# EasyEDA schematic SCH_Fetch Execution Counter_2021-10-10.json
TITLE: Fetch Execution Counter; REV: 1.0; Date: 2021-09-30; Sheet: 1/1; Drawn By: MarcosObel; Company: Zutup All Electronics
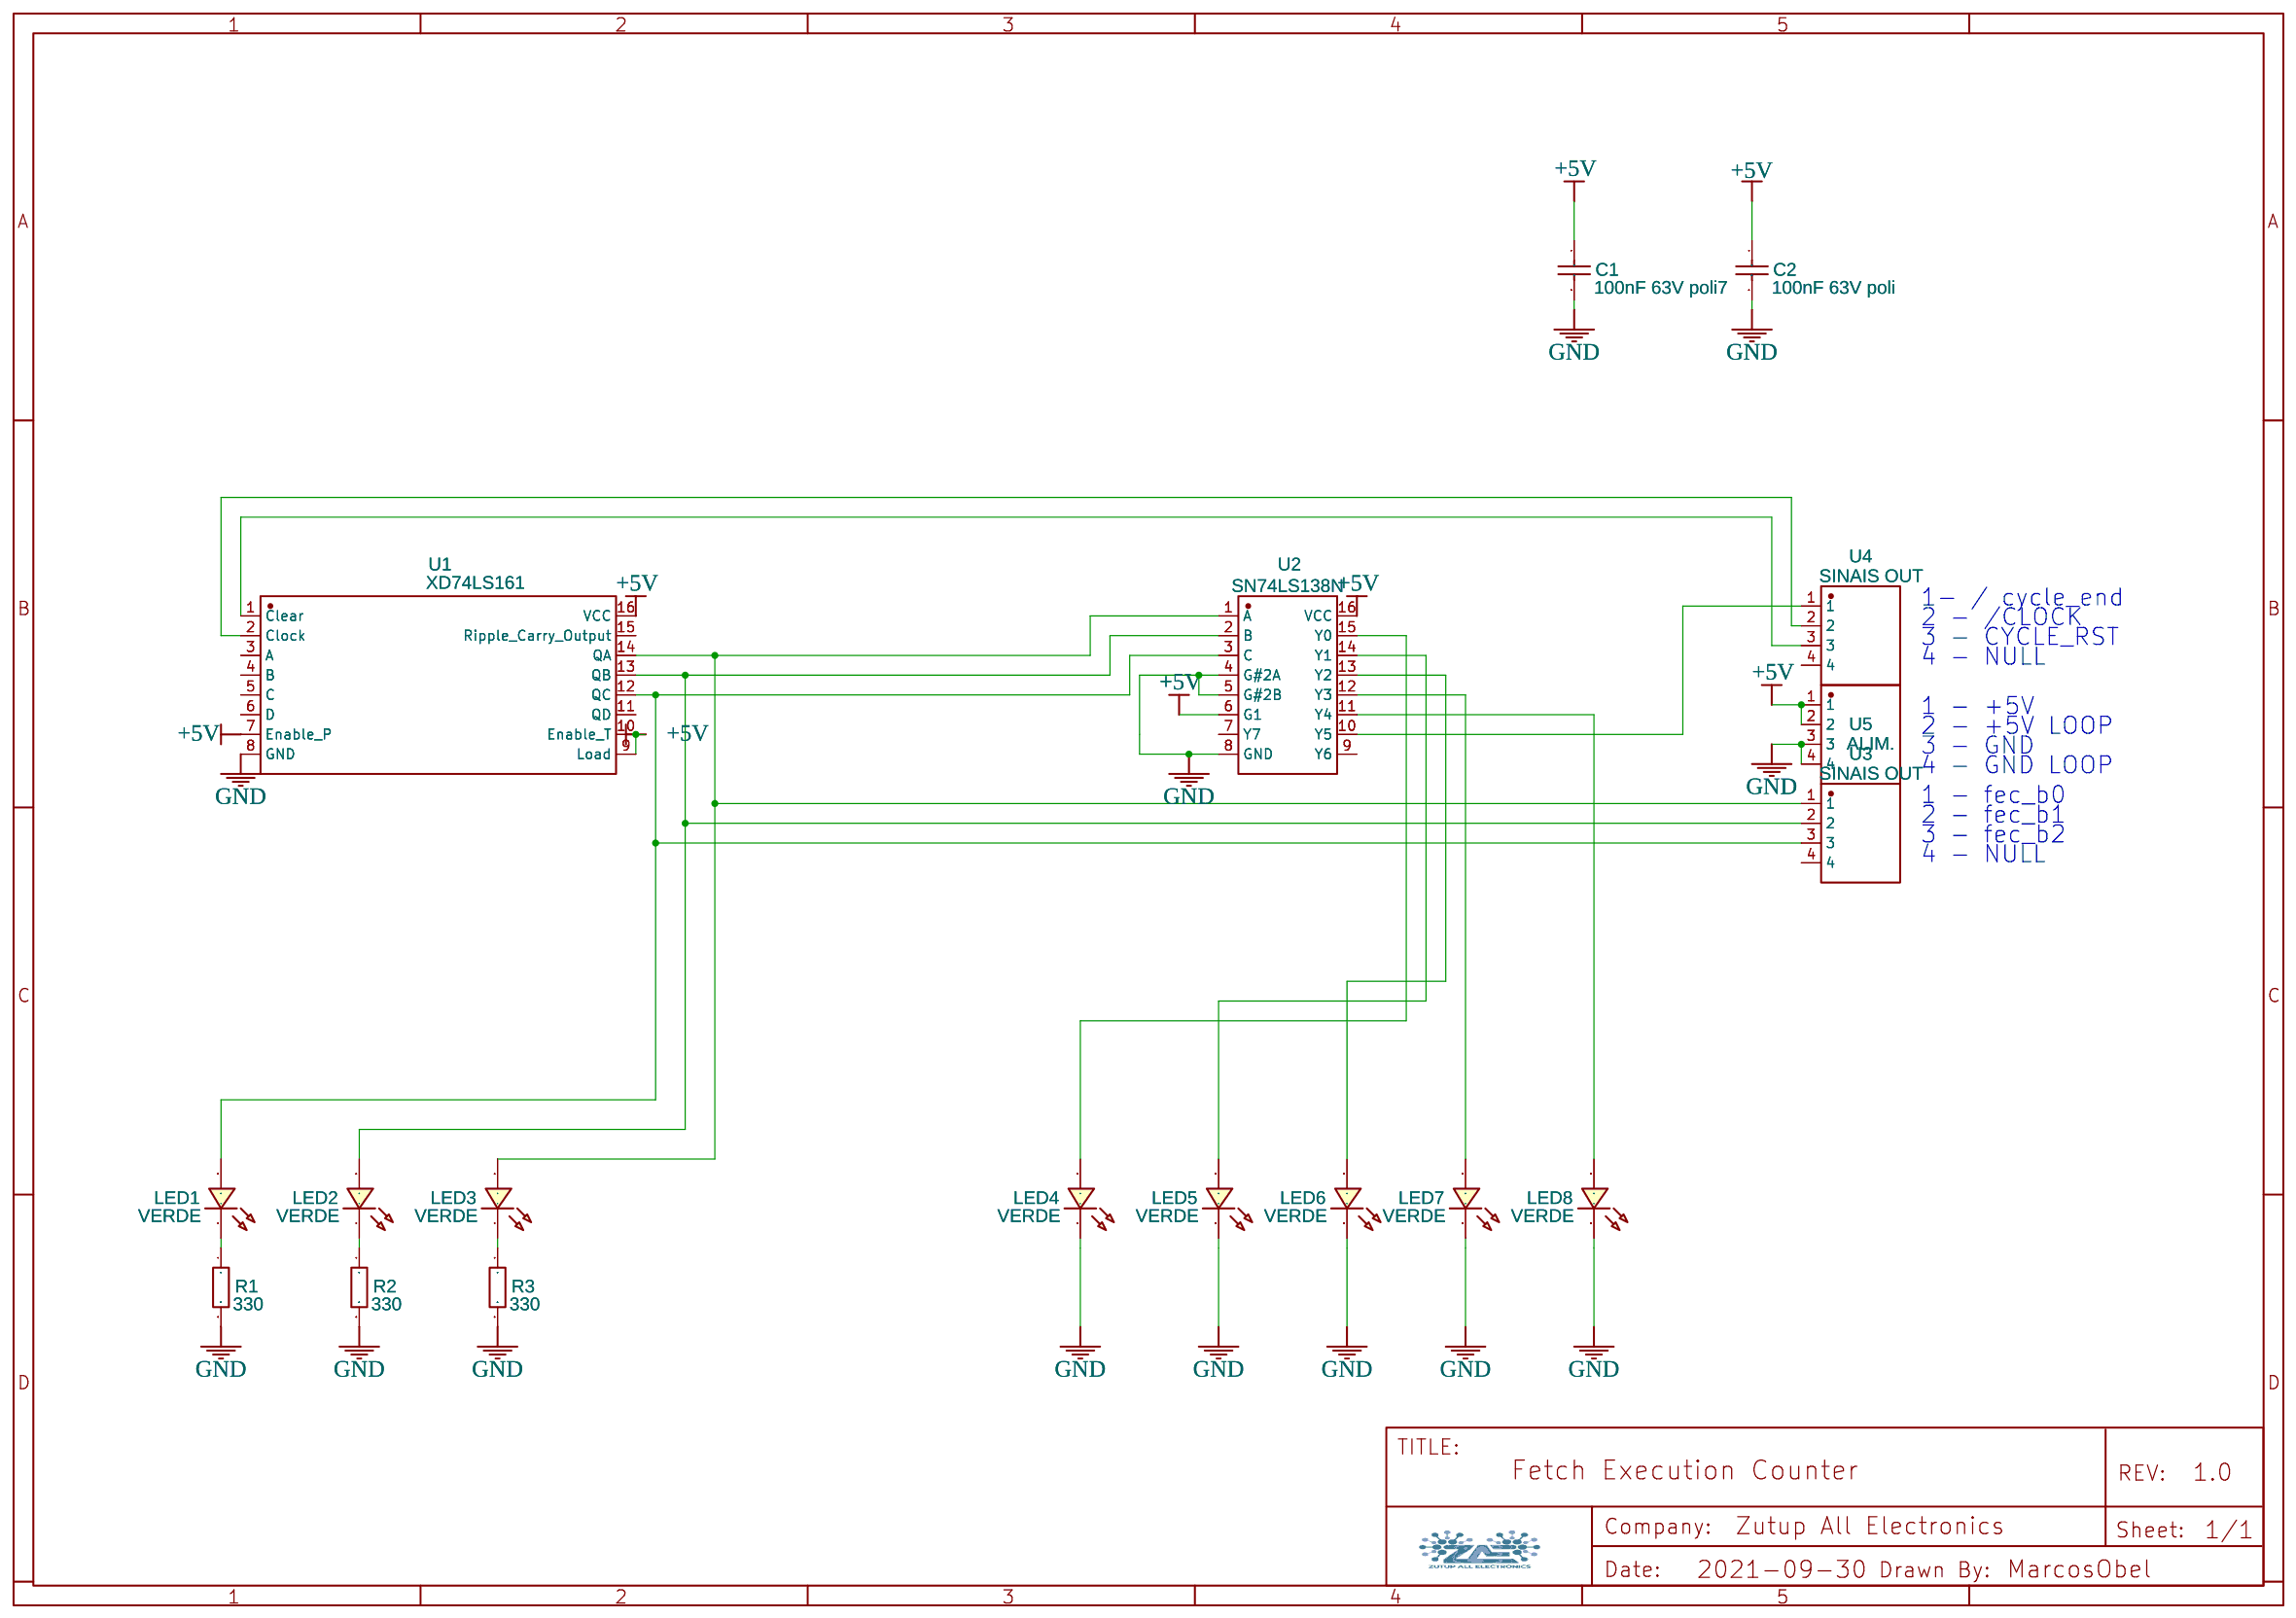
[diagram p0: schematic sheet]

## Parts
C1  100nF 63V poli7  [CAP-TH_L7.6-W3.8-P5.08-D0.51]
C2  100nF 63V poli  [CAP-TH_L7.6-W3.8-P5.08-D0.51]
LED1  VERDE  [LED-TH_BD3.0-P2.54-RD-GREEN]
LED2  VERDE  [LED-TH_BD3.0-P2.54-RD-GREEN]
LED3  VERDE  [LED-TH_BD3.0-P2.54-RD-GREEN]
LED4  VERDE  [LED-TH_BD3.0-P2.54-RD-GREEN]
LED5  VERDE  [LED-TH_BD3.0-P2.54-RD-GREEN]
LED6  VERDE  [LED-TH_BD3.0-P2.54-RD-GREEN]
LED7  VERDE  [LED-TH_BD3.0-P2.54-RD-GREEN]
LED8  VERDE  [LED-TH_BD3.0-P2.54-RD-GREEN]
R1  330  [RES-TH_BD3.0-L9.5-P13.50-D0.6]
R2  330  [RES-TH_BD3.0-L9.5-P13.50-D0.6]
R3  330  [RES-TH_BD3.0-L9.5-P13.50-D0.6]
U1  XD74LS161  [DIP-16_L19.2-W6.6-P2.54-LS7.6-BL]
U2  SN74LS138N  [DIP-16_L19.8-W6.5-P2.54-LS7.6-BL]
U3  SINAIS OUT  [HDR-TH_4P-P2.54-D1.0]
U4  SINAIS OUT  [HDR-TH_4P-P2.54-D1.0]
U5  ALIM.  [HDR-TH_4P-P2.54-D1.0]

## Library data of the parts
C1 C2 = SR305C105KAR: Supplier: LCSC; Supplier Part: C444741; Manufacturer: AVX; Contributor: LCSC; JLCPCB Part Class: Extended Part
LED1-LED8 = 264-7GD: Supplier: LCSC; Supplier Part: C605465; Manufacturer: Everlight Elec; Contributor: LCSC; JLCPCB Part Class: Extended Part
R1-R3 = CFR02SJ0823A10: Supplier: LCSC; Manufacturer: UniOhm; Supplier Part: C69876
U1 = XD74LS161: Supplier: LCSC; Supplier Part: C609766; Manufacturer: XINLUDA; Contributor: LCSC; JLCPCB Part Class: Extended Part
U2 = SN74LS138N: Supplier: LCSC; Supplier Part: C352964; Manufacturer: Texas Instruments; Contributor: LCSC; JLCPCB Part Class: Extended Part
U3-U5 = 171825-4: Supplier: LCSC; Supplier Part: C210162; Manufacturer: TE Connectivity; Contributor: LCSC; JLCPCB Part Class: Extended Part

## Nets
+5V: C1.1 C2.1 U1.7(Enable P) U1.9(Load) U1.10(Enable T) U1.16(VCC) U2.6(G1) U2.16(VCC) U5.1 U5.2
GND: C1.2 C2.2 LED4.1(-) LED5.1(-) LED6.1(-) LED7.1(-) LED8.1(-) R1.2 R2.2 R3.2 U1.8(GND) U2.4(G#2A) U2.5(G#2B) U2.8(GND) U5.3 U5.4
Net-(LED1-1): LED1.1(-) R1.1
Net-(LED1-2): LED1.2(+) U1.12(QC) U2.3(C) U3.3
Net-(LED2-1): LED2.1(-) R2.1
Net-(LED2-2): LED2.2(+) U1.13(QB) U2.2(B) U3.2
Net-(LED3-1): LED3.1(-) R3.1
Net-(LED3-2): LED3.2(+) U1.14(QA) U2.1(A) U3.1
Net-(LED4-2): LED4.2(+) U2.15(Y0)
Net-(LED5-2): LED5.2(+) U2.14(Y1)
Net-(LED6-2): LED6.2(+) U2.13(Y2)
Net-(LED7-2): LED7.2(+) U2.12(Y3)
Net-(LED8-2): LED8.2(+) U2.11(Y4)
Net-(U1-1): U1.1(Clear) U4.3
Net-(U1-2): U1.2(Clock) U4.2
Net-(U2-10): U2.10(Y5) U4.1

Not connected (* = marked no-connect by the designer): U1 3(A) 4(B) 5(C) 6(D) 11(QD) 15(Ripple Carry Output); U2 7(Y7) 9(Y6); U3 4; U4 4

## Notes on the sheet
- 1- / cycle_end
- 2 - /CLOCK
- 3 - CYCLE_RST
- 4 - NULL
- 1 - +5V
- 2 - +5V LOOP
- 3 - GND
- 4 - GND LOOP
- 1 - fec_b0
- 2 - fec_b1
- 3 - fec_b2
- 4 - NULL
